# Altium project HW_FPGA_Board.PrjPcb (part 2 of 2)

## Sheet FPGA_ADC4.SchDoc
size A4
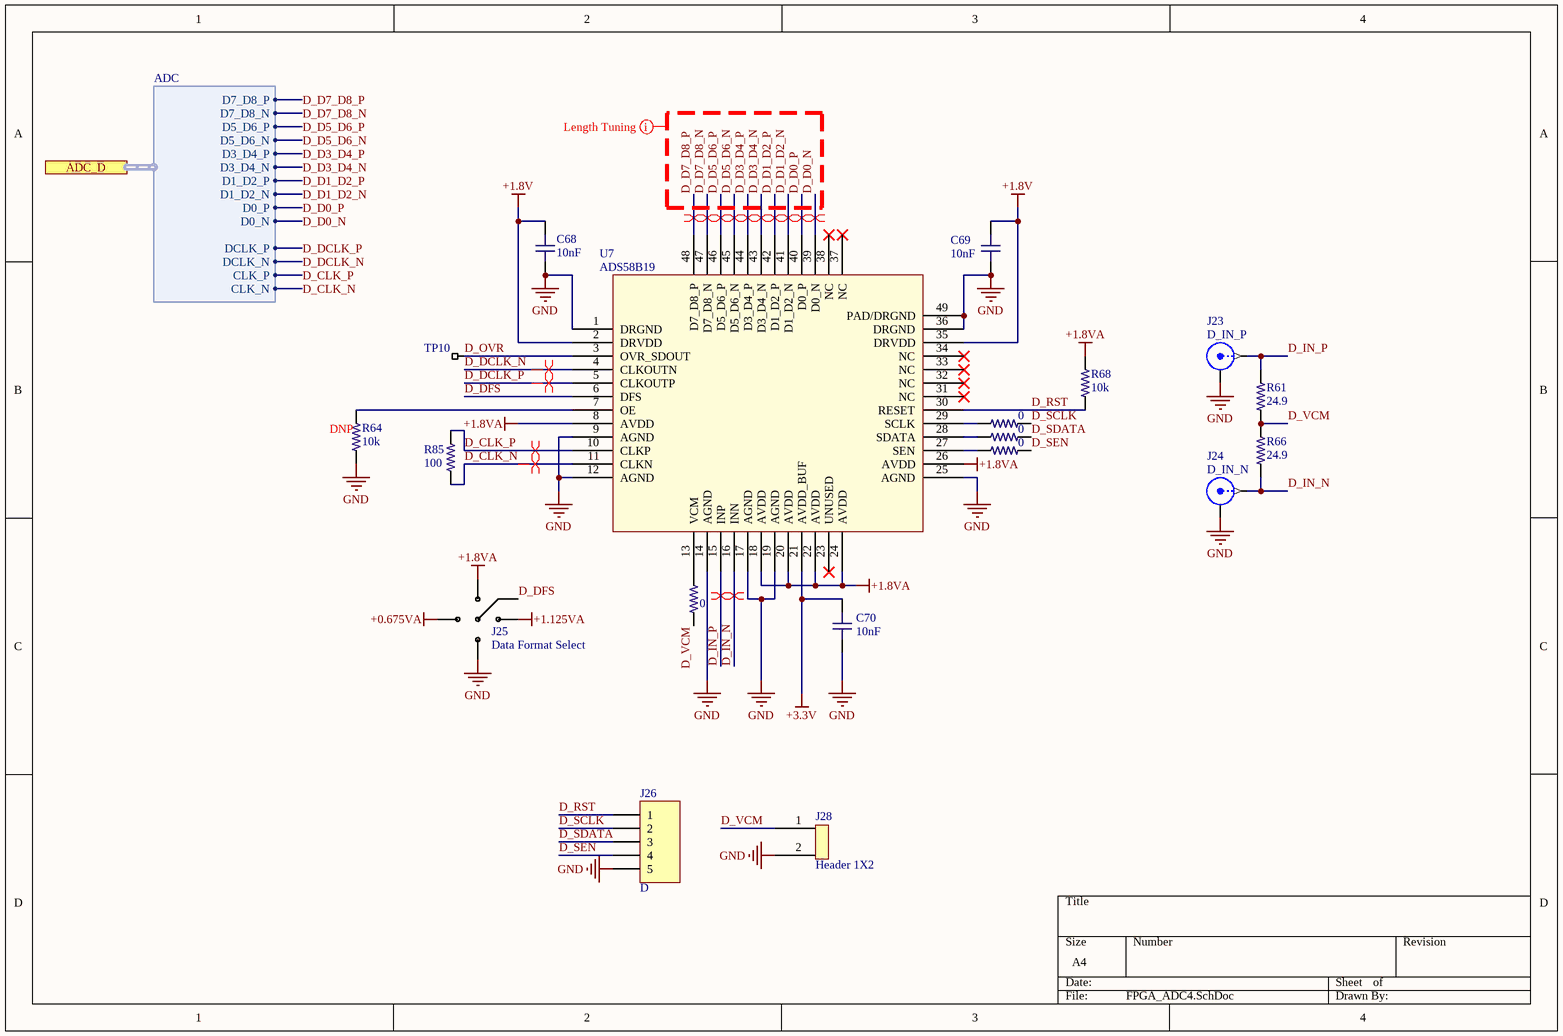
[diagram p9: FPGA_ADC4.SchDoc]

### Parts
C68  value 10nF  [C0603-HIGH-DENSITY]  (hidden comment: C0603 10nF 50V X7R)
C69  value 10nF  [C0603-HIGH-DENSITY]  (hidden comment: C0603 10nF 50V X7R)
C70  value 10nF  [C0603-HIGH-DENSITY]  (hidden comment: C0603 10nF 50V X7R)
J23  D_IN_P  [SMA Edge Launch (Horizontal)]
J24  D_IN_N  [SMA Edge Launch (Horizontal)]
J25  Data Format Select  [4P Jumper]
J26  D  [HDR1X5]
J28  Header 1X2  [Header 1x2 TH Pitch 2.54mm]
R61  value 24.9  [R0603-HIGH-DENSITY]  (hidden comment: RC0603FR-0724R9L)
R62  value 0  [R0603-IPC]  (hidden comment: R0603 0)
R63  value 0  [R0603-IPC]  (hidden comment: R0603 0)
R64  value 10k  [R0603-IPC-10K]  (hidden comment: R0603 10K 1%)
R65  value 0  [R0603-IPC]  (hidden comment: R0603 0)
R66  value 24.9  [R0603-HIGH-DENSITY]  (hidden comment: RC0603FR-0724R9L)
R67  value 0  [R0603-IPC]  (hidden comment: R0603 0)
R68  value 10k  [R0603-IPC-10K]  (hidden comment: R0603 10K 1%)
R85  value 100  [R0402-HIGH-DENSITY]  (hidden comment: R0402 100R 1%)
TP10  Testpoint_SMT  [TESTPOINT_SMT]  (value not drawn)  (no BOM)
U7  ADS58B19  [VQFN48]

### Ports
ADC_D (harness ADC)

### Harnesses
ADC: D7_D8_P, D7_D8_N, D5_D6_P, D5_D6_N, D3_D4_P, D3_D4_N, D1_D2_P, D1_D2_N, D0_P, D0_N, CLK_P, CLK_N, DCLK_P, DCLK_N

### Nets
+0.675VA: J25.4
+1.8V: C68.1 C69.1 U7.2(DRVDD) U7.35(DRVDD)
+1.8VA: J25.1 R68.2 U7.8(AVDD) U7.18(AVDD) U7.20(AVDD) U7.22(AVDD) U7.24(AVDD) U7.26(AVDD)
+1.125VA: J25.2
+3.3V: C70.1 U7.21(AVDD_BUF)
GND: C68.2 C69.2 C70.2 J23.2(Y) J24.2(Y) J25.3 J26.5 J28.2 R64.1 U7.1(DRGND) U7.9(AGND) U7.12(AGND) U7.14(AGND) U7.17(AGND) U7.19(AGND) U7.25(AGND) U7.36(DRGND) U7.49(PAD/DRGND)
D_CLK_N: R85.1 U7.11(CLKN) ; port ADC_D.CLK_N
D_CLK_P: R85.2 U7.10(CLKP) ; port ADC_D.CLK_P
D_D0_N: U7.39(D0_N) ; port ADC_D.D0_N
D_D0_P: U7.40(D0_P) ; port ADC_D.D0_P
D_D1_D2_N: U7.41(D1_D2_N) ; port ADC_D.D1_D2_N
D_D1_D2_P: U7.42(D1_D2_P) ; port ADC_D.D1_D2_P
D_D3_D4_N: U7.43(D3_D4_N) ; port ADC_D.D3_D4_N
D_D3_D4_P: U7.44(D3_D4_P) ; port ADC_D.D3_D4_P
D_D5_D6_N: U7.45(D5_D6_N) ; port ADC_D.D5_D6_N
D_D5_D6_P: U7.46(D5_D6_P) ; port ADC_D.D5_D6_P
D_D7_D8_N: U7.47(D7_D8_N) ; port ADC_D.D7_D8_N
D_D7_D8_P: U7.48(D7_D8_P) ; port ADC_D.D7_D8_P
D_DCLK_N: U7.4(CLKOUTN) ; port ADC_D.DCLK_N
D_DCLK_P: U7.5(CLKOUTP) ; port ADC_D.DCLK_P
D_DFS: J25.5 U7.6(DFS)
D_IN_N: J24.1(X) R66.1 U7.16(INN)
D_IN_P: J23.1(X) R61.2 U7.15(INP)
D_OVR: TP10.1 U7.3(OVR_SDOUT)
D_RST: J26.1 R68.1 U7.30(RESET)
D_SCLK: J26.2 R62.2
D_SDATA: J26.3 R63.2
D_SEN: J26.4 R65.2
D_VCM: J28.1 R61.1 R66.2 R67.2
NetR62_1: R62.1 U7.29(SCLK)
NetR63_1: R63.1 U7.28(SDATA)
NetR64_2: R64.2 U7.7(OE)
NetR65_1: R65.1 U7.27(SEN)
NetR67_1: R67.1 U7.13(VCM)

Not connected (* = marked no-connect by the designer): U7 23(UNUSED)* 31(NC)* 32(NC)* 33(NC)* 34(NC)* 37(NC)* 38(NC)*

### Layout directives
differential pair: D_D0_N, D_D0_P, D_D1_D2_N, D_D1_D2_P, D_D3_D4_N, D_D3_D4_P, D_D5_D6_N, D_D5_D6_P, D_D7_D8_N, D_D7_D8_P
differential pair; differential pair class ADC_CLK: D_CLK_N, D_CLK_P, D_DCLK_N, D_DCLK_P
differential pair; differential pair class AnalogIn: D_IN_N, D_IN_P
net class ADC_DATA - 150mil; net class ADC_DATA_D: D_D0_N, D_D0_P, D_D1_D2_N, D_D1_D2_P, D_D3_D4_N, D_D3_D4_P, D_D5_D6_N, D_D5_D6_P, D_D7_D8_N, D_D7_D8_P

### Notes on the sheet
- (near R64) DNP

### Library data of the parts
C68-C70 = C0603 10nF 50V X7R: CAP CER 10000PF 50V X7R 0603; EIA Code: X7R; Max. Voltage: 50V; Features: Soft Termination; Supplier 1: Digi-Key; Supplier Part Number 1: 490-10892-1-ND
J23 J24 = SMA: SMA Connector; Supplier 1: Digi-Key; Supplier Part Number 1: A97594-ND
J25 = 4P Jumper: 0603 4 Way Solder Jumper
J26 = Header 5: Header, 5-Pin; LatestRevisionDate: 17-Jul-2002; LatestRevisionNote: Re-released for DXP Platform.; Publisher: Altium Limited
R61 R66 = R0603 24.9R 1%: Chip Resistor, 0603, 24.9 ohms, 0.1W; Supplier 1: Digi-Key; Supplier 2: Mouser; Supplier Part Number 1: 311-24.9HRCT-ND; Supplier Part Number 2: 603-RC0603FR-0724R9L
R62 R63 R65 R67 = R0603 0: RES SMD 0 OHM JUMPER 1/10W 0603; Supplier 1: Digi-Key; Supplier Part Number 1: RMCF0603ZT0R00CT-ND
R64 R68 = R0603 10K 1%: RES SMD 10K OHM 1% 1/10W 0603; Supplier 1: Digi-Key; Supplier Part Number 1: RMCF0603FT10K0CT-ND
R85 = R0402 100R 1%: Chip Resistor, 0402, 100 ohms, 1%, 1/16 W; Supplier 1: Digi-Key; Supplier Part Number 1: 311-100LRCT-ND
TP10 = Testpoint_SMT: SMT Test Point
U7 = ADS58B19: Single ADC Pipelined 250Msps 9-bit Parallel/LVDS 48-Pin VQFN; Supplier 1: Digi-Key; Supplier 2: Mouser; Supplier Part Number 1: 296-28296-1-ND; Supplier Part Number 2: 595-ADS58B19IRGZT

## Sheet FPGA_Memory.SchDoc
size A3
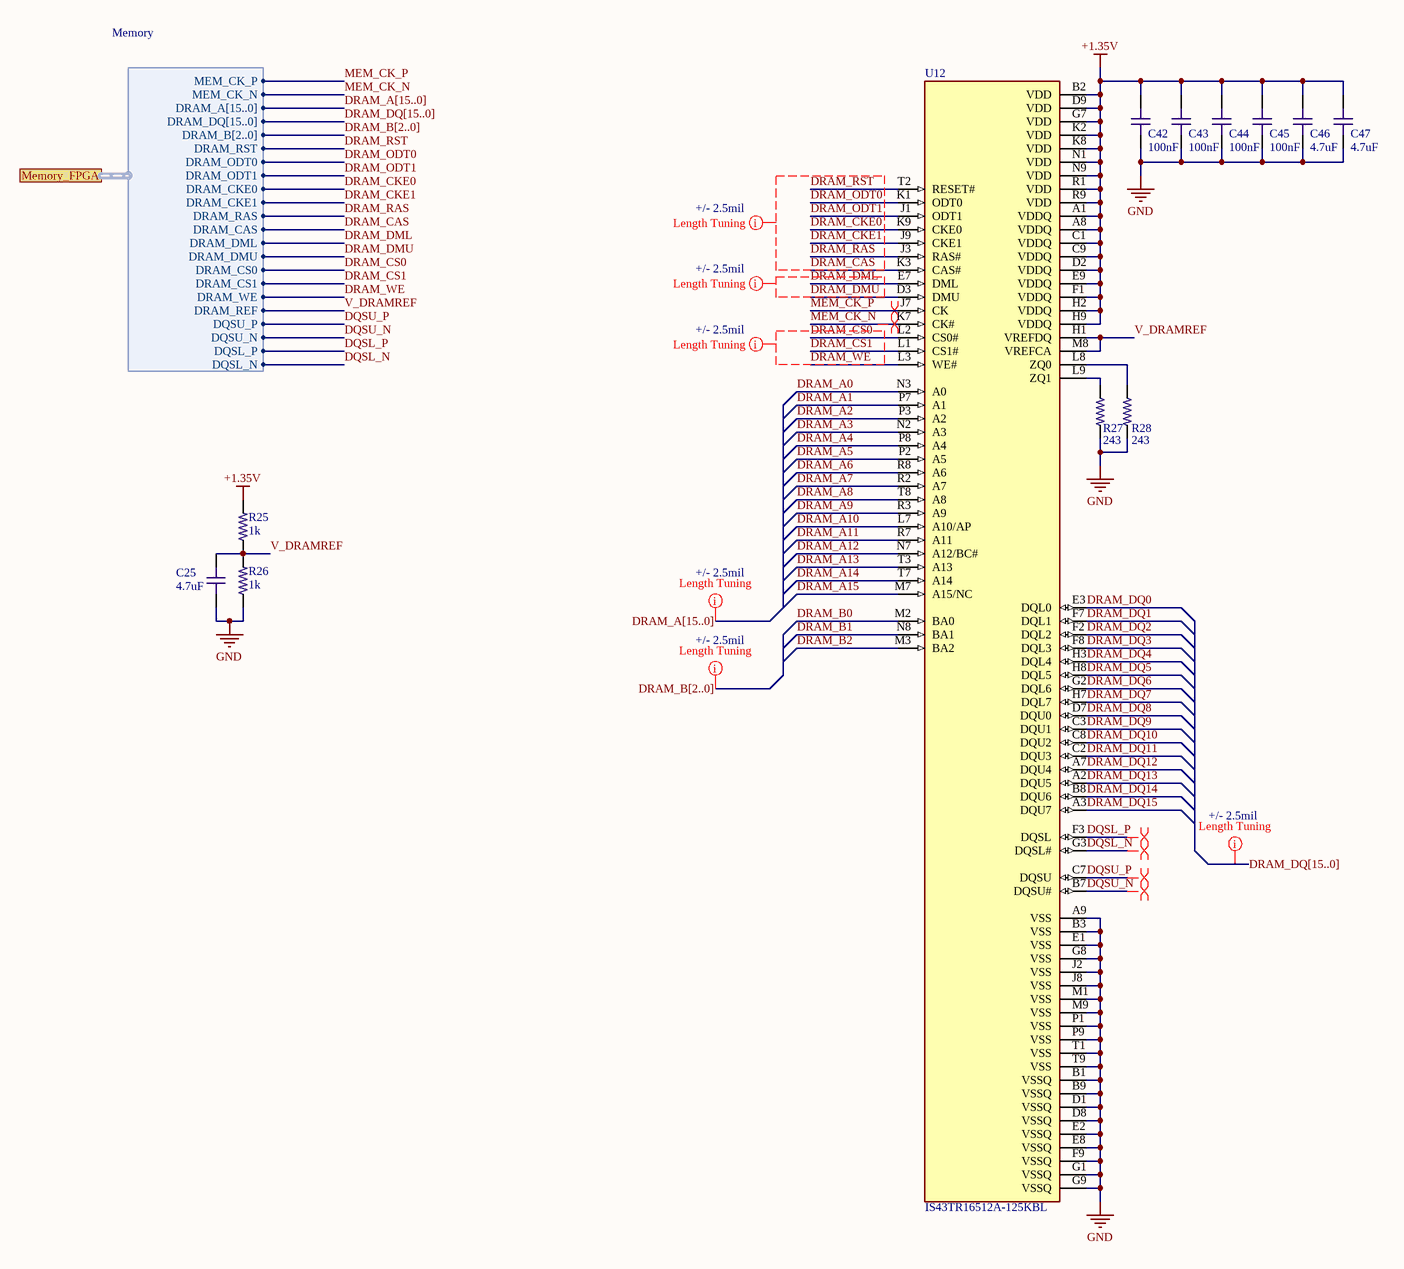
[diagram p10: FPGA_Memory.SchDoc]

### Parts
C25  value 4.7uF  [C0603-HIGH-DENSITY]  (hidden comment: 4.7uF, 25V, X5R, 0603)
C42  value 100nF  [C0603-HIGH-DENSITY]  (hidden comment: C0603 100nF 25V X7R)
C43  value 100nF  [C0603-HIGH-DENSITY]  (hidden comment: C0603 100nF 25V X7R)
C44  value 100nF  [C0603-HIGH-DENSITY]  (hidden comment: C0603 100nF 25V X7R)
C45  value 100nF  [C0603-HIGH-DENSITY]  (hidden comment: C0603 100nF 25V X7R)
C46  value 4.7uF  [C0603-HIGH-DENSITY]  (hidden comment: 4.7uF, 25V, X5R, 0603)
C47  value 4.7uF  [C0603-HIGH-DENSITY]  (hidden comment: 4.7uF, 25V, X5R, 0603)
R25  value 1k  [R0603-IPC-1K]  (hidden comment: R0603 1K 1%)
R26  value 1k  [R0603-IPC-1K]  (hidden comment: R0603 1K 1%)
R27  value 243  [R0603-IPC]  (hidden comment: R0603 243 1%)
R28  value 243  [R0603-IPC]  (hidden comment: R0603 243 1%)
U12  IS43TR16512A-125KBL  [BGA96C80P9X16_1000X1400X140N]

### Ports
Memory_FPGA (harness Memory)

### Harnesses
Memory: MEM_CK_P, MEM_CK_N, DRAM_A[15..0], DRAM_DQ[15..0], DRAM_B[2..0], DRAM_RST, DRAM_ODT0, DRAM_ODT1, DRAM_CKE0, DRAM_CKE1, DRAM_RAS, DRAM_CAS, DRAM_DML, DRAM_DMU, DRAM_CS0, DRAM_CS1, DRAM_WE, DRAM_REF, DQSU_P, DQSU_N, DQSL_P, DQSL_N

### Nets
+1.35V: C42.2 C43.2 C44.2 C45.2 C46.2 C47.2 R25.2 U12.A1(VDDQ) U12.A8(VDDQ) U12.B2(VDD) U12.C1(VDDQ) U12.C9(VDDQ) U12.D2(VDDQ) U12.D9(VDD) U12.E9(VDDQ) U12.F1(VDDQ) U12.G7(VDD) U12.H2(VDDQ) U12.H9(VDDQ) U12.K2(VDD) U12.K8(VDD) U12.N1(VDD) U12.N9(VDD) U12.R1(VDD) U12.R9(VDD)
GND: C25.1 C42.1 C43.1 C44.1 C45.1 C46.1 C47.1 R26.1 R27.2 R28.2 U12.A9(VSS) U12.B1(VSSQ) U12.B3(VSS) U12.B9(VSSQ) U12.D1(VSSQ) U12.D8(VSSQ) U12.E1(VSS) U12.E2(VSSQ) U12.E8(VSSQ) U12.F9(VSSQ) U12.G1(VSSQ) U12.G8(VSS) U12.G9(VSSQ) U12.J2(VSS) U12.J8(VSS) U12.M1(VSS) U12.M9(VSS) U12.P1(VSS) U12.P9(VSS) U12.T1(VSS) U12.T9(VSS)
DQSL_N: U12.G3(DQSL#) ; port Memory_FPGA.DQSL_N
DQSL_P: U12.F3(DQSL) ; port Memory_FPGA.DQSL_P
DQSU_N: U12.B7(DQSU#) ; port Memory_FPGA.DQSU_N
DQSU_P: U12.C7(DQSU) ; port Memory_FPGA.DQSU_P
DRAM_A0: U12.N3(A0)
DRAM_A1: U12.P7(A1)
DRAM_A2: U12.P3(A2)
DRAM_A3: U12.N2(A3)
DRAM_A4: U12.P8(A4)
DRAM_A5: U12.P2(A5)
DRAM_A6: U12.R8(A6)
DRAM_A7: U12.R2(A7)
DRAM_A8: U12.T8(A8)
DRAM_A9: U12.R3(A9)
DRAM_A10: U12.L7(A10/AP)
DRAM_A11: U12.R7(A11)
DRAM_A12: U12.N7(A12/BC#)
DRAM_A13: U12.T3(A13)
DRAM_A14: U12.T7(A14)
DRAM_A15: U12.M7(A15/NC)
DRAM_B0: U12.M2(BA0)
DRAM_B1: U12.N8(BA1)
DRAM_B2: U12.M3(BA2)
DRAM_CAS: U12.K3(CAS#) ; port Memory_FPGA.DRAM_CAS
DRAM_CKE0: U12.K9(CKE0) ; port Memory_FPGA.DRAM_CKE0
DRAM_CKE1: U12.J9(CKE1) ; port Memory_FPGA.DRAM_CKE1
DRAM_CS0: U12.L2(CS0#) ; port Memory_FPGA.DRAM_CS0
DRAM_CS1: U12.L1(CS1#) ; port Memory_FPGA.DRAM_CS1
DRAM_DML: U12.E7(DML) ; port Memory_FPGA.DRAM_DML
DRAM_DMU: U12.D3(DMU) ; port Memory_FPGA.DRAM_DMU
DRAM_DQ0: U12.E3(DQL0)
DRAM_DQ1: U12.F7(DQL1)
DRAM_DQ2: U12.F2(DQL2)
DRAM_DQ3: U12.F8(DQL3)
DRAM_DQ4: U12.H3(DQL4)
DRAM_DQ5: U12.H8(DQL5)
DRAM_DQ6: U12.G2(DQL6)
DRAM_DQ7: U12.H7(DQL7)
DRAM_DQ8: U12.D7(DQU0)
DRAM_DQ9: U12.C3(DQU1)
DRAM_DQ10: U12.C8(DQU2)
DRAM_DQ11: U12.C2(DQU3)
DRAM_DQ12: U12.A7(DQU4)
DRAM_DQ13: U12.A2(DQU5)
DRAM_DQ14: U12.B8(DQU6)
DRAM_DQ15: U12.A3(DQU7)
DRAM_ODT0: U12.K1(ODT0) ; port Memory_FPGA.DRAM_ODT0
DRAM_ODT1: U12.J1(ODT1) ; port Memory_FPGA.DRAM_ODT1
DRAM_RAS: U12.J3(RAS#) ; port Memory_FPGA.DRAM_RAS
DRAM_RST: U12.T2(RESET#) ; port Memory_FPGA.DRAM_RST
DRAM_WE: U12.L3(WE#) ; port Memory_FPGA.DRAM_WE
MEM_CK_N: U12.K7(CK#) ; port Memory_FPGA.MEM_CK_N
MEM_CK_P: U12.J7(CK) ; port Memory_FPGA.MEM_CK_P
V_DRAMREF: C25.2 R25.1 R26.2 U12.H1(VREFDQ) U12.M8(VREFCA) ; port Memory_FPGA.DRAM_REF
NetR27_1: R27.1 U12.L9(ZQ1)
NetR28_1: R28.1 U12.L8(ZQ0)

### Buses and harness runs
bus DRAM_A[15..0]
bus DRAM_B[2..0]
bus DRAM_DQ[15..0]

### Layout directives
net class DRAM_DATA - 150mil; rule Matched Net Lengths [Tolerance = 5mil]: (no net found under the mark), DRAM_DML, DRAM_DMU
net class DRAM_ADD - 150mil; rule Matched Net Lengths [Tolerance = 5mil]: (no net found under the mark), DRAM_CAS, DRAM_CKE0, DRAM_CKE1, DRAM_CS0, DRAM_CS1, DRAM_ODT0, DRAM_ODT1, DRAM_RAS, DRAM_RST, DRAM_WE
differential pair; differential pair class MEM_CLK; net class DIFF100: MEM_CK_N, MEM_CK_P
differential pair; differential pair class DQSL; net class DIFF100: DQSL_N, DQSL_P
differential pair; differential pair class DQSU; net class DIFF100: DQSU_N, DQSU_P

### Notes on the sheet
- +/- 2.5mil

### Library data of the parts
C25 C46 C47 = C0603 4.7uF 25V X5R: Chip Capacitor, 0603, 4.7uF, 25V, X5R; EIA Code: X5R; Max. Voltage: 25V; Supplier 1: Digi-Key; Supplier 2: Mouser; Supplier 3: LCSC; Supplier Part Number 1: 490-7203-1-ND; Supplier Part Number 2: 81-GRM188R61E475KE1D; Supplier Part Number 3: C90057
C42-C45 = C0603 100nF 25V X7R: Chip Capacitor, 0603, 100nF, 25V, X7R; EIA Code: X7R; Max. Voltage: 25V; Supplier 1: Digi-Key; Supplier Part Number 1: 490-1524-1-ND
R25 R26 = R0603 1K 1%: RES SMD 1K OHM 1% 1/10W 0603; Temperature Coefficient: ±100ppm/°C; Operating Temperature: -55°C ~ 155°C; Features: Automotive AEC-Q200; Tolerance: ±1%; Supplier 1: Digi-Key; Supplier Part Number 1: RMCF0603FG1K00CT-ND
R27 R28 = R0603 243 1%: RES SMD 243 OHM 1% 1/10W 0603; Temperature Coefficient: ±100ppm/°C; Tolerance: ±1%; Features: Automotive AEC-Q200; Operating Temperature: -55°C ~ 155°C; Supplier 1: Digi-Key; Supplier Part Number 1: RMCF0603FT243RCT-ND
U12 = IS43TR16512A/L-125KBL: SDRAM - DDR3L Memory IC 8Gb (512M x 16) Parallel 800MHz 20ns 96-LFBGA (10x14); MF: ISSI, Integrated; MP: IS43TR16512AL-125KBL; Package: LFBGA-96 ISSI; Supplier 1: Digi-Key; Supplier 2: Mouser; Supplier Part Number 1: 706-1459-ND; Supplier Part Number 2: 870-43TR16512A125KBL

## Nets that join several sheets
+0.675VA: FPGA_ADC_TOP (R34.1 R35.2), FPGA_ADC1 (J2.4), FPGA_ADC2 (J11.4), FPGA_ADC3 (J18.4), FPGA_ADC4 (J25.4)
+1.8V: FPGA_Power (9 pins), FPGA_FPGA (9 pins), FPGA_ADC1 (C59.1 C60.1 U4.2 U4.35), FPGA_ADC2 (C62.1 C63.1 U5.2 U5.35), FPGA_ADC3 (C65.1 C66.1 U6.2 U6.35), FPGA_ADC4 (C68.1 C69.1 U7.2 U7.35)
+1.8VA: FPGA_Power (L14.2), FPGA_ADC_TOP (R33.2), FPGA_ADC1 (8 pins), FPGA_ADC2 (8 pins), FPGA_ADC3 (8 pins), FPGA_ADC4 (8 pins)
+1.35V: FPGA_Power (7 pins), FPGA_FPGA (11 pins), FPGA_Memory (25 pins)
+1.125VA: FPGA_ADC_TOP (R33.1 R34.2), FPGA_ADC1 (J2.2), FPGA_ADC2 (J11.2), FPGA_ADC3 (J18.2), FPGA_ADC4 (J25.2)
+3.3V: FPGA_Power (7 pins), FPGA_FPGA (26 pins), FPGA_JTAG (23 pins), FPGA_ADC1 (C61.1 U4.21), FPGA_ADC2 (C64.1 U5.21), FPGA_ADC3 (C67.1 U6.21), FPGA_ADC4 (C70.1 U7.21)
+5V: FPGA_Power (7 pins), FPGA_JTAG (J8.A4 J8.A9 J8.B4 J8.B9)
GND: FPGA_Power (67 pins), FPGA_FPGA (32 pins), FPGA_JTAG (42 pins), FPGA_ADC_TOP (R35.1), FPGA_ADC1 (19 pins), FPGA_ADC2 (18 pins), FPGA_ADC3 (18 pins), FPGA_ADC4 (18 pins), FPGA_Memory (31 pins)
A_CLK_N: FPGA_FPGA (U1.M2), FPGA_ADC1 (R82.1 U4.11)
A_CLK_P: FPGA_FPGA (U1.M1), FPGA_ADC1 (R82.2 U4.10)
A_D0_N: FPGA_FPGA (U1.T4), FPGA_ADC1 (U4.39)
A_D0_P: FPGA_FPGA (U1.R5), FPGA_ADC1 (U4.40)
A_D1_D2_N: FPGA_FPGA (U1.T3), FPGA_ADC1 (U4.41)
A_D1_D2_P: FPGA_FPGA (U1.R4), FPGA_ADC1 (U4.42)
A_D3_D4_N: FPGA_FPGA (U1.R3), FPGA_ADC1 (U4.43)
A_D3_D4_P: FPGA_FPGA (U1.P4), FPGA_ADC1 (U4.44)
A_D5_D6_N: FPGA_FPGA (U1.T2), FPGA_ADC1 (U4.45)
A_D5_D6_P: FPGA_FPGA (U1.R2), FPGA_ADC1 (U4.46)
A_D7_D8_N: FPGA_FPGA (U1.P2), FPGA_ADC1 (U4.47)
A_D7_D8_P: FPGA_FPGA (U1.N1), FPGA_ADC1 (U4.48)
A_DCLK_N: FPGA_FPGA (U1.R1), FPGA_ADC1 (U4.4)
A_DCLK_P: FPGA_FPGA (U1.P1), FPGA_ADC1 (U4.5)
B_CLK_N: FPGA_FPGA (U1.L2), FPGA_ADC2 (R83.1 U5.11)
B_CLK_P: FPGA_FPGA (U1.L1), FPGA_ADC2 (R83.2 U5.10)
B_D0_N: FPGA_FPGA (U1.P3), FPGA_ADC2 (U5.39)
B_D0_P: FPGA_FPGA (U1.N4), FPGA_ADC2 (U5.40)
B_D1_D2_N: FPGA_FPGA (U1.P5), FPGA_ADC2 (U5.41)
B_D1_D2_P: FPGA_FPGA (U1.P6), FPGA_ADC2 (U5.42)
B_D3_D4_N: FPGA_FPGA (U1.N6), FPGA_ADC2 (U5.43)
B_D3_D4_P: FPGA_FPGA (U1.M6), FPGA_ADC2 (U5.44)
B_D5_D6_N: FPGA_FPGA (U1.N5), FPGA_ADC2 (U5.45)
B_D5_D6_P: FPGA_FPGA (U1.M5), FPGA_ADC2 (U5.46)
B_D7_D8_N: FPGA_FPGA (U1.N3), FPGA_ADC2 (U5.47)
B_D7_D8_P: FPGA_FPGA (U1.M4), FPGA_ADC2 (U5.48)
B_DCLK_N: FPGA_FPGA (U1.M3), FPGA_ADC2 (U5.4)
B_DCLK_P: FPGA_FPGA (U1.L3), FPGA_ADC2 (U5.5)
C_CLK_N: FPGA_FPGA (U1.K2), FPGA_ADC3 (R84.1 U6.11)
C_CLK_P: FPGA_FPGA (U1.K1), FPGA_ADC3 (R84.2 U6.10)
C_D0_N: FPGA_FPGA (U1.L5), FPGA_ADC3 (U6.39)
C_D0_P: FPGA_FPGA (U1.L4), FPGA_ADC3 (U6.40)
C_D1_D2_N: FPGA_FPGA (U1.K5), FPGA_ADC3 (U6.41)
C_D1_D2_P: FPGA_FPGA (U1.K4), FPGA_ADC3 (U6.42)
C_D3_D4_N: FPGA_FPGA (U1.K3), FPGA_ADC3 (U6.43)
C_D3_D4_P: FPGA_FPGA (U1.J3), FPGA_ADC3 (U6.44)
C_D5_D6_N: FPGA_FPGA (U1.J5), FPGA_ADC3 (U6.45)
C_D5_D6_P: FPGA_FPGA (U1.J4), FPGA_ADC3 (U6.46)
C_D7_D8_N: FPGA_FPGA (U1.H4), FPGA_ADC3 (U6.47)
C_D7_D8_P: FPGA_FPGA (U1.H5), FPGA_ADC3 (U6.48)
C_DCLK_N: FPGA_FPGA (U1.H2), FPGA_ADC3 (U6.4)
C_DCLK_P: FPGA_FPGA (U1.G1), FPGA_ADC3 (U6.5)
D_CLK_N: FPGA_FPGA (U1.J2), FPGA_ADC4 (R85.1 U7.11)
D_CLK_P: FPGA_FPGA (U1.J1), FPGA_ADC4 (R85.2 U7.10)
D_D0_N: FPGA_FPGA (U1.G2), FPGA_ADC4 (U7.39)
D_D0_P: FPGA_FPGA (U1.F1), FPGA_ADC4 (U7.40)
D_D1_D2_N: FPGA_FPGA (U1.E1), FPGA_ADC4 (U7.41)
D_D1_D2_P: FPGA_FPGA (U1.F2), FPGA_ADC4 (U7.42)
D_D3_D4_N: FPGA_FPGA (U1.E2), FPGA_ADC4 (U7.43)
D_D3_D4_P: FPGA_FPGA (U1.D1), FPGA_ADC4 (U7.44)
D_D5_D6_N: FPGA_FPGA (U1.C2), FPGA_ADC4 (U7.45)
D_D5_D6_P: FPGA_FPGA (U1.C1), FPGA_ADC4 (U7.46)
D_D7_D8_N: FPGA_FPGA (U1.D3), FPGA_ADC4 (U7.47)
D_D7_D8_P: FPGA_FPGA (U1.C3), FPGA_ADC4 (U7.48)
D_DCLK_N: FPGA_FPGA (U1.B2), FPGA_ADC4 (U7.4)
D_DCLK_P: FPGA_FPGA (U1.B1), FPGA_ADC4 (U7.5)
DQSL_N: FPGA_FPGA (U1.R14), FPGA_Memory (U12.G3)
DQSL_P: FPGA_FPGA (U1.P13), FPGA_Memory (U12.F3)
DQSU_N: FPGA_FPGA (U1.T15), FPGA_Memory (U12.B7)
DQSU_P: FPGA_FPGA (U1.R15), FPGA_Memory (U12.C7)
DRAM_A0: FPGA_FPGA (U1.F13), FPGA_Memory (U12.N3)
DRAM_A1: FPGA_FPGA (U1.M15), FPGA_Memory (U12.P7)
DRAM_A2: FPGA_FPGA (U1.K13), FPGA_Memory (U12.P3)
DRAM_A3: FPGA_FPGA (U1.D14), FPGA_Memory (U12.N2)
DRAM_A4: FPGA_FPGA (U1.K12), FPGA_Memory (U12.P8)
DRAM_A5: FPGA_FPGA (U1.C14), FPGA_Memory (U12.P2)
DRAM_A6: FPGA_FPGA (U1.D16), FPGA_Memory (U12.R8)
DRAM_A7: FPGA_FPGA (U1.N13), FPGA_Memory (U12.R2)
DRAM_A8: FPGA_FPGA (U1.P14), FPGA_Memory (U12.T8)
DRAM_A9: FPGA_FPGA (U1.E14), FPGA_Memory (U12.R3)
DRAM_A10: FPGA_FPGA (U1.E15), FPGA_Memory (U12.L7)
DRAM_A11: FPGA_FPGA (U1.C16), FPGA_Memory (U12.R7)
DRAM_A12: FPGA_FPGA (U1.G12), FPGA_Memory (U12.N7)
DRAM_A13: FPGA_FPGA (U1.B16), FPGA_Memory (U12.T3)
DRAM_A14: FPGA_FPGA (U1.B15), FPGA_Memory (U12.T7)
DRAM_A15: FPGA_FPGA (U1.L12), FPGA_Memory (U12.M7)
DRAM_B0: FPGA_FPGA (U1.F12), FPGA_Memory (U12.M2)
DRAM_B1: FPGA_FPGA (U1.L13), FPGA_Memory (U12.N8)
DRAM_B2: FPGA_FPGA (U1.P15), FPGA_Memory (U12.M3)
DRAM_CAS: FPGA_FPGA (U1.P16), FPGA_Memory (U12.K3)
DRAM_CKE0: FPGA_FPGA (U1.F14), FPGA_Memory (U12.K9)
DRAM_CKE1: FPGA_FPGA (U1.L14), FPGA_Memory (U12.J9)
DRAM_CS0: FPGA_FPGA (U1.M13), FPGA_Memory (U12.L2)
DRAM_CS1: FPGA_FPGA (U1.R16), FPGA_Memory (U12.L1)
DRAM_DML: FPGA_FPGA (U1.R13), FPGA_Memory (U12.E7)
DRAM_DMU: FPGA_FPGA (U1.T14), FPGA_Memory (U12.D3)
DRAM_DQ0: FPGA_FPGA (U1.F15), FPGA_Memory (U12.E3)
DRAM_DQ1: FPGA_FPGA (U1.E16), FPGA_Memory (U12.F7)
DRAM_DQ2: FPGA_FPGA (U1.F16), FPGA_Memory (U12.F2)
DRAM_DQ3: FPGA_FPGA (U1.G15), FPGA_Memory (U12.F8)
DRAM_DQ4: FPGA_FPGA (U1.G14), FPGA_Memory (U12.H3)
DRAM_DQ5: FPGA_FPGA (U1.H14), FPGA_Memory (U12.H8)
DRAM_DQ6: FPGA_FPGA (U1.H12), FPGA_Memory (U12.G2)
DRAM_DQ7: FPGA_FPGA (U1.H13), FPGA_Memory (U12.H7)
DRAM_DQ8: FPGA_FPGA (U1.J13), FPGA_Memory (U12.D7)
DRAM_DQ9: FPGA_FPGA (U1.J12), FPGA_Memory (U12.C3)
DRAM_DQ10: FPGA_FPGA (U1.J14), FPGA_Memory (U12.C8)
DRAM_DQ11: FPGA_FPGA (U1.K14), FPGA_Memory (U12.C2)
DRAM_DQ12: FPGA_FPGA (U1.J16), FPGA_Memory (U12.A7)
DRAM_DQ13: FPGA_FPGA (U1.J15), FPGA_Memory (U12.A2)
DRAM_DQ14: FPGA_FPGA (U1.K16), FPGA_Memory (U12.B8)
DRAM_DQ15: FPGA_FPGA (U1.K15), FPGA_Memory (U12.A3)
DRAM_ODT0: FPGA_FPGA (U1.G13), FPGA_Memory (U12.K1)
DRAM_ODT1: FPGA_FPGA (U1.N14), FPGA_Memory (U12.J1)
DRAM_RAS: FPGA_FPGA (U1.M14), FPGA_Memory (U12.J3)
DRAM_RST: FPGA_FPGA (U1.C15), FPGA_Memory (U12.T2)
DRAM_WE: FPGA_FPGA (U1.N16), FPGA_Memory (U12.L3)
FPGA_TCK: FPGA_FPGA (U1.T10), FPGA_JTAG (J1.4 R4.2 U2.16)
FPGA_TDI: FPGA_FPGA (U1.R11), FPGA_JTAG (J1.8 R2.1 U2.17)
FPGA_TDO: FPGA_FPGA (U1.M10), FPGA_JTAG (J1.6 R3.1 U2.18)
FPGA_TMS: FPGA_FPGA (U1.T11), FPGA_JTAG (J1.2 R1.1 U2.19)
MEM_CK_N: FPGA_FPGA (U1.L15), FPGA_Memory (U12.K7)
MEM_CK_P: FPGA_FPGA (U1.L16), FPGA_Memory (U12.J7)
V_DRAMREF: FPGA_FPGA (U1.M16), FPGA_Memory (5 pins)